# Altium schematic sheet AIWAC-TF_CARD-V02.SchDoc
size A4
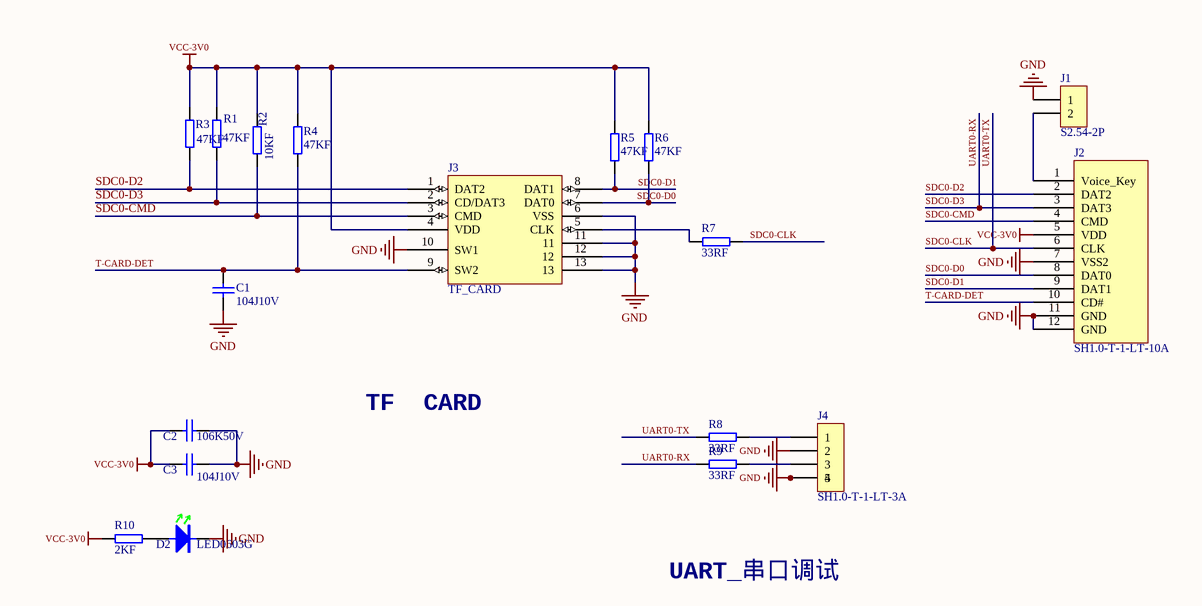
[diagram p0: AIWAC-TF_CARD-V02.SchDoc]

## Parts
C1  104J10V  [C0402]
C2  106K50V  [C0603]
C3  104J10V  [C0402]
D2  LED0603G  [D-LED0603G]
J1  S2.54-2P  [S2.54-2P]
J2  SH1.0-T-1-LT-10A  [J-SH1.0-T-1-LT-10A]
J3  TF_CARD  [SD_CARD_7]
J4  SH1.0-T-1-LT-3A  [J-SH1.0-T-1-LT-3A]
R1  47KF  [R0603]
R2  10KF  [R0603]
R3  47KF  [R0603]
R4  47KF  [R0603]
R5  47KF  [R0603]
R6  47KF  [R0603]
R7  33RF  [R0603]
R8  33RF  [R0603]
R9  33RF  [R0603]
R10  2KF  [R0603]

## Nets
GND: C1.2 C2.1 C3.1 D2.2 J1.1 J2.7(VSS2) J2.11(GND) J2.12(GND) J3.6(VSS) J3.10(SW1) J3.11 J3.12 J3.13 J4.2 J4.4 J4.5
VCC-3V0: C2.2 C3.2 J2.5(VDD) J3.4(VDD) R1.2 R2.2 R3.2 R4.2 R5.2 R6.2 R10.1
SDC0-CLK: J2.6(CLK) R7.1 R8.1  [also labelled UART0-TX]
SDC0-CMD: J2.4(CMD) J3.3(CMD) R2.1
SDC0-D0: J2.8(DAT0) J3.7(DAT0) R6.1
SDC0-D1: J2.9(DAT1) J3.8(DAT1) R5.1
SDC0-D2: J2.2(DAT2) J3.1(DAT2) R3.1
SDC0-D3: J2.3(DAT3) J3.2(CD/DAT3) R1.1 R9.1  [also labelled UART0-RX]
T-CARD-DET: C1.1 J2.10(CD#) J3.9(SW2) R4.1
NetD2_1: D2.1 R10.2
NetJ1_2: J1.2 J2.1(Voice_Key)
NetJ3_5: J3.5(CLK) R7.2
NetJ4_1: J4.1 R8.2
NetJ4_3: J4.3 R9.2

## Notes on the sheet
- TF  CARD
- UART_串口调试

## Library data of the parts
C1 C3 = C0402X7R-104J10V: 贴片电容-陶瓷; 规格型号: 100nF±5%_10V_X7R_C0402; 生产商: 风华 三星; 供应商: *; 备注: *
C2 = C0603X7R-106K50V: 贴片电容-陶瓷; 规格型号: 10uF±10%_50V_X7R_C0603; 生产商: 风华 三星; 供应商: *; 备注: *
D2 = DLED-0603-G: 贴片二极管-LED; 规格型号: 0603-GREEN; 货品编码: 无样品无编码; 生产商: *; 供应商: *; 备注: *
J1 = J-S2.54-2P: 单排排针-直针; 货品编码: 372013; 供应商: *; 规格型号: S2.54-2P; 备注: *
J2 = SH1.0-T-1-LT-10A: 接插件SH1.0-T-1-LT-10A; value: 供给TF卡的座子
J3 = TF_CARD: MS110-C10B-C16
J4 = SH1.0-T-1-LT-3A: 接插件-SH1.0-T-1-LT-3A; 规格型号: 1.0m立式贴片插座3P/SH1.0-T-1-LT-3A; 供应商: *; 备注: *
R1 R3-R6 = R0603-47KF: 贴片电阻-通用; 生产商: 厚声 国巨; 规格型号: 47K±1%_1/10W_±200ppm_R0603; 货品编码: 无样品无编码; 备注: *; 供应商: *
R2 = R0603-10KF: 贴片电阻-通用; 生产商: 厚声 国巨; 规格型号: 10K±1%_1/10W_±200ppm_R0603; 备注: *; 供应商: *
R7-R9 = R0603-33RF: 贴片电阻-通用; 生产商: 厚声 国巨; 规格型号: 33R±1%_1/10W_±200ppm_R0603; 货品编码: 无样品无编码; 备注: *; 供应商: *
R10 = R0603-2KF: 贴片电阻-通用; 生产商: 厚声 国巨; 规格型号: 2K±1%_1/10W_±200ppm_R0603; 备注: *; 供应商: *